# Altium schematic sheet AT Guard Simple Mems.SchDoc
size A4
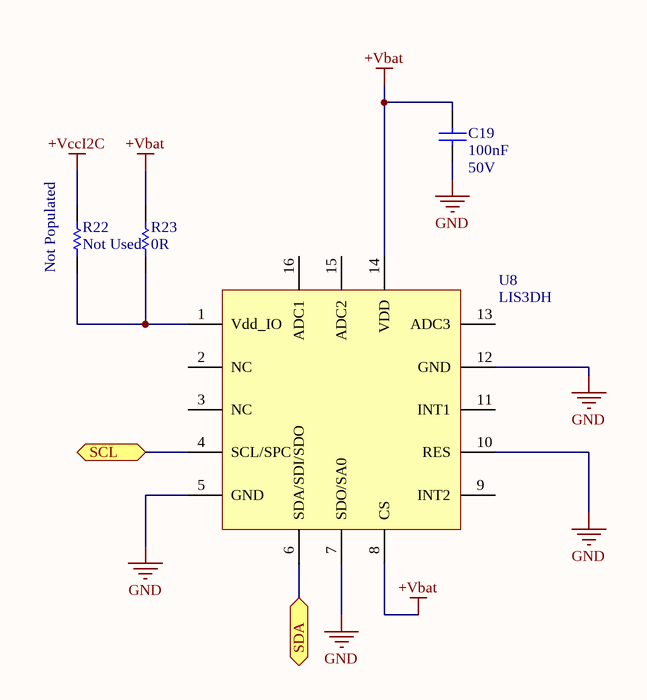
[diagram p0: AT Guard Simple Mems.SchDoc]

## Parts
C19  value 100nF  Voltage: 50V  [3-0603_L]  (hidden comment: Cap)
R22  value Not Used  [3-0603_L]  (hidden comment: Res1)
R23  value 0R  [3-0603_L]  (hidden comment: Res1)
U8  LIS3DH  [LGA 16]

## Ports
SCL (bidir), SDA (bidir)

## Nets
+Vbat: C19.1 R23.1 U8.8(CS) U8.14(VDD)
+VccI2C: R22.1
GND: C19.2 U8.5(GND) U8.7(SDO/SA0) U8.10(RES) U8.12(GND)
SCL: U8.4(SCL/SPC) ; port SCL
SDA: U8.6(SDA/SDI/SDO) ; port SDA
NetR22_2: R22.2 R23.2 U8.1(Vdd_IO)

Not connected (* = marked no-connect by the designer): U8 2(NC) 3(NC) 9(INT2) 11(INT1) 13(ADC3) 15(ADC2) 16(ADC1)

## Notes on the sheet
- (near R22) Not Populated

## Library data of the parts
C19 = Cap: Capacitor; Published: 8-Jun-2000; Revision: July-2002: Re-released for DXP Platform.; Publisher: Altium Limited
R22 R23 = Res1: Resistor; Published: 8-Jun-2000; LatestRevisionDate: 17-Jul-2002; LatestRevisionNote: Re-released for DXP Platform.; PackageReference: AXIAL-0.3; Publisher: Altium Limited
U8 = LIS3DH: 3-axis - ±2g analog output “nano” accelerometer; FirstPublished: 29-Jan-2009; LatestRevisionDate: 27-Nov-2009; LatestRevisionNote: Updated to datasheet revision B, May-2009; DatasheetVersion: revB, May-2009; PackageVersion: revBB, Aug-2009; PackageReference: QFN-ML20; Publisher: Altium Limited; PackageDescription: 20-Lead Plastic Quad Flat, No Lead Package (ML) - 4x4x0.9 mm Body [QFN]; ComponentLink1Description: Datasheet; ComponentLink1URL: http://ww1.microchip.com/downloads/en/DeviceDoc/22090b.pdf; ComponentLink2Description: Packaging Specification; ComponentLink2URL: http://www.microchip.com/stellent/groups/techpub_sg/documents/packagingspec/en012702.pdf; ComponentLink3Description: Microchip.com Home; ComponentLink3URL: http://www.microchip.com/